# Altium project FLEXI_HAL_2000.PrjPCB (part 3 of 3)

## Sheet 2xparallelswitch_HALT.SchDoc: RP2040 CNC
size B; Author: AM; CompanyName: Expatria Technologies; DrawnBy: A.Marles; Engineer: AM; Organization: Expatria Technolgoies; DocumentNumber: 13; Revision: A5; SheetNumber: 13; SheetTotal: 14
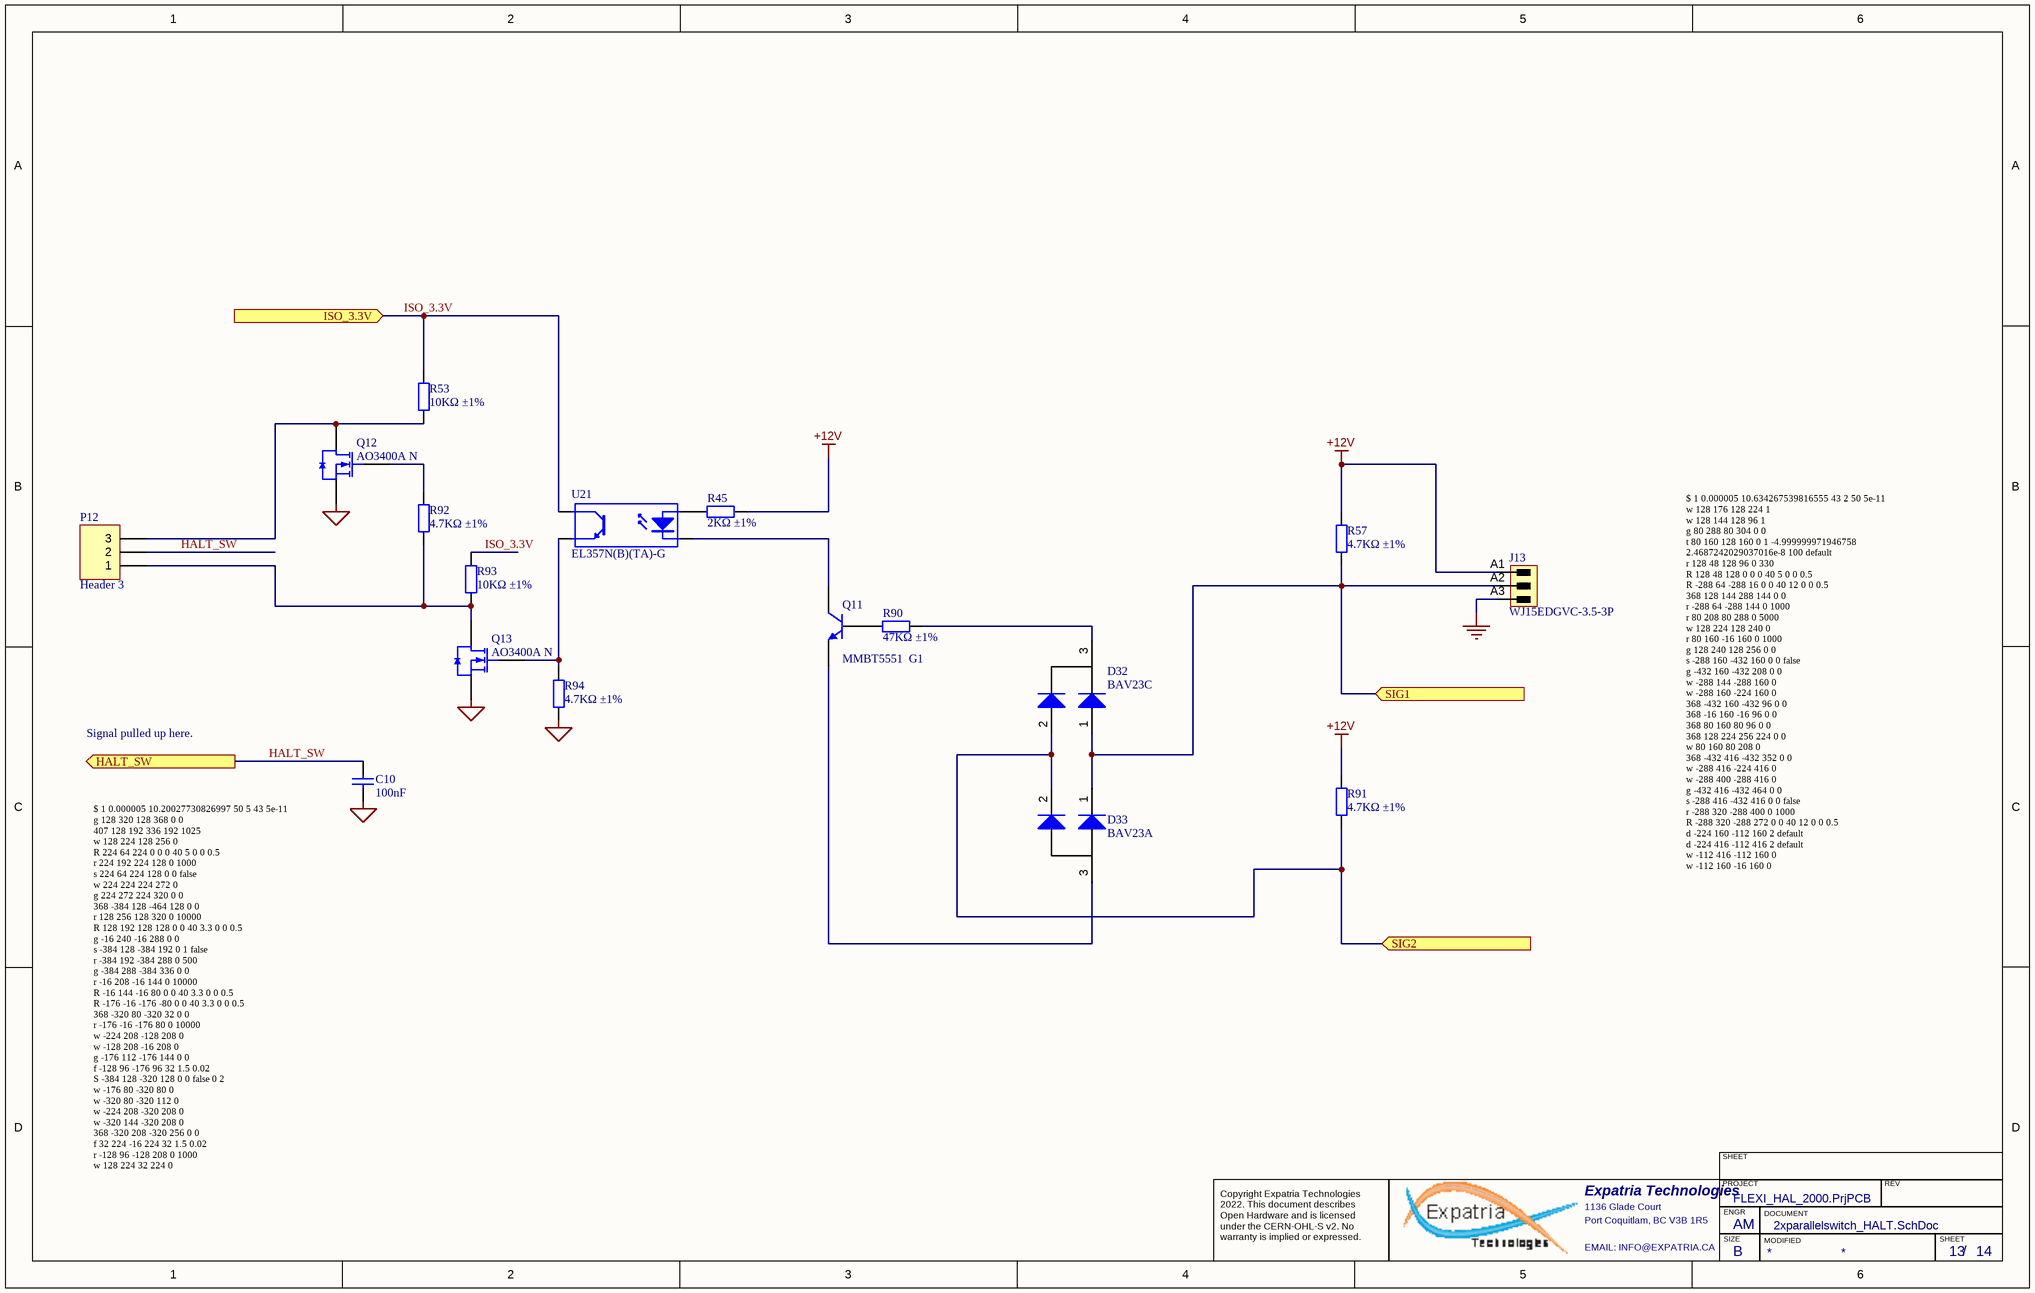
[diagram p12: 2xparallelswitch_HALT.SchDoc]

### Parts
C10  100nF  [0603_C]
D32  BAV23C  [SOT-23(SOT-23-3)]
D33  BAV23A  [SOT-23(SOT-23-3)]
J13  WJ15EDGVC-3.5-3P  [691321100003 - 3.5mm  3p]
P12  Header 3  [HDR1X3]
Q11  MMBT5551  G1  [SOT-23(SOT-23-3)]
Q12  AO3400A N  [SOT-23-3L]
Q13  AO3400A N  [SOT-23-3L]
R45  2KΩ ±1%  [0603_R]
R53  10KΩ ±1%  [0603_R]
R57  4.7KΩ ±1%  [0603_R]
R90  47KΩ ±1%  [0603_R]
R91  4.7KΩ ±1%  [0603_R]
R92  4.7KΩ ±1%  [0603_R]
R93  10KΩ ±1%  [0603_R]
R94  4.7KΩ ±1%  [0603_R]
U21  EL357N(B)(TA)-G  [SOP-4_P2.54]

### Ports
HALT_SW (out), ISO_3.3V (in), SIG1 (in), SIG2 (in)

### Nets
+12V: J13.A1 R45.2 R57.2 R91.2
GND: J13.A3
MCU_GND: C10.1 Q12.2(S) Q13.2(S) R94.1
HALT_SW: C10.2 P12.2 ; port HALT_SW
ISO_3.3V: R53.2 R93.2 U21.4(C) ; port ISO_3.3V
SIG1: D32.1(A) D33.1(K) J13.A2 R57.1 ; port SIG1
SIG2: D32.2(A) D33.2(K) R91.1 ; port SIG2
NetD32_3: D32.3(K) R90.1
NetD33_3: D33.3(A) Q11.2(E)
NetP12_1: P12.1 Q13.3(D) R92.1 R93.1
NetP12_3: P12.3 Q12.3(D) R53.1
NetQ11_1: Q11.1(B) R90.2
NetQ11_3: Q11.3(C) U21.2(K)
NetQ12_1: Q12.1(G) R92.2
NetQ13_1: Q13.1(G) R94.2 U21.3(E)
NetR45_1: R45.1 U21.1(A)

### Notes on the sheet
- Signal pulled up here.
- $ 1 0.000005 10.634267539816555 43 2 50 5e-11
  w 128 176 128 224 1
  w 128 144 128 96 1
  g 80 288 80 304 0 0
  t 80 160 128 160 0 1 -4.999999971946758 2.4687242029037016e-8 100 default
  r 128 48 128 96 0 330
  R 128 48 128 0 0 0 40 5 0 0 0.5
  R -288 64 -288 16 0 0 40 12 0 0 0.5
  368 128 144 288 144 0 0
  r -288 64 -288 144 0 1000
  r 80 208 80 288 0 5000
  w 128 224 128 240 0
  r 80 160 -16 160 0 1000
  g 128 240 128 256 0 0
  s -288 160 -432 160 0 0 false
  g -432 160 -432 208 0 0
  w -288 144 -288 160 0
  w -288 160 -224 160 0
  368 -432 160 -432 96 0 0
  368 -16 160 -16 96 0 0
  368 80 160 80 96 0 0
  368 128 224 256 224 0 0
  w 80 160 80 208 0
  368 -432 416 -432 352 0 0
  w -288 416 -224 416 0
  w -288 400 -288 416 0
  g -432 416 -432 464 0 0
  s -288 416 -432 416 0 0 false
  r -288 320 -288 400 0 1000
  R -288 320 -288 272 0 0 40 12 0 0 0.5
  d -224 160 -112 160 2 default
  d -224 416 -112 416 2 default
  w -112 416 -112 160 0
  w -112 160 -16 160 0
- (near C10) $ 1 0.000005 10.20027730826997 50 5 43 5e-11
  g 128 320 128 368 0 0
  407 128 192 336 192 1025
  w 128 224 128 256 0
  R 224 64 224 0 0 0 40 5 0 0 0.5
  r 224 192 224 128 0 1000
  s 224 64 224 128 0 0 false
  w 224 224 224 272 0
  g 224 272 224 320 0 0
  368 -384 128 -464 128 0 0
  r 128 256 128 320 0 10000
  R 128 192 128 128 0 0 40 3.3 0 0 0.5
  g -16 240 -16 288 0 0
  s -384 128 -384 192 0 1 false
  r -384 192 -384 288 0 500
  g -384 288 -384 336 0 0
  r -16 208 -16 144 0 10000
  R -16 144 -16 80 0 0 40 3.3 0 0 0.5
  R -176 -16 -176 -80 0 0 40 3.3 0 0 0.5
  368 -320 80 -320 32 0 0
  r -176 -16 -176 80 0 10000
  w -224 208 -128 208 0
  w -128 208 -16 208 0
  g -176 112 -176 144 0 0
  f -128 96 -176 96 32 1.5 0.02
  S -384 128 -320 128 0 0 false 0 2
  w -176 80 -320 80 0
  w -320 80 -320 112 0
  w -224 208 -320 208 0
  w -320 144 -320 208 0
  368 -320 208 -320 256 0 0
  f 32 224 -16 224 32 1.5 0.02
  r -128 96 -128 208 0 1000
  w 128 224 32 224 0
- SHEET
- Expatria Technologies
- 1136 Glade Court
- Port Coquitlam, BC V3B 1R5
- PROJECT
- SIZE
- ENGR
- MODIFIED
- DOCUMENT
- REV
- Copyright Expatria Technologies 2022. This document describes Open Hardware and is licensed under the CERN-OHL-S v2. No warranty is implied or expressed.
- EMAIL: INFO@EXPATRIA.CA
- B
- /

### Library data of the parts
C10 = 0603 100nF (104) 10% 50V: Chip capacitors; Manufacturer: YAGEO; PartNumber: CC0603KRX7R9BB104; Tolerance: 10%; Voltage: 50V; ComponentLink1Description: Supplier link; ComponentLink1URL: http://www.szlcsc.com/product/details_15331.html; Package: 0603; Supplier: LC; SuppliersPartNumber: C14663; Capacitance: 100nF
D32 = SOT-23 BAV23C: 250V +150℃@(Tj) 350mW Dual Common Cathode 1.25V@200mA 50ns 100nA@250V 225mA SOT-23 Switching Diode ROHS; ComponentLink1Description: 供应商链接; ComponentLink1URL: http://www.szlcsc.com/product/details_70091.html; Package: SOT-23; Supplier: LC; SuppliersPartNumber: C545540
D33 = SOT-23 BAV23A: 200V -65℃~+150℃@(Tj) 350mW 1 Pair Common Anode 1.25V@200mA 50ns 100nA@200V 400mA SOT-23 Switching Diode ROHS; ComponentLink1Description: 供应商链接; ComponentLink1URL: http://www.szlcsc.com/product/details_70091.html; Package: SOT-23; Supplier: LC; SuppliersPartNumber: C328584
J13 = 3.5mm Terminal Header 3p: Header,Male Pin,Covered(4 Sided) 3 1 0.138"（3.50mm） 3 P=3.5mm Pluggable System Terminal Block RoHS; Manufacturer: Weidmueller; Manufacturer 1: Weidmuller; Manufacturer Part Number 1: 1604480000; Pitch_mm: 3.5 mm; UL_94_flammability_rating: V-0; Side_termination_characteristic: closed side; Solder_pin_length_mm: 3.2 mm; Short_text_for_material: SL 3.50/03/180G 3.2SN OR BX; Pitch_inch: 0.138 inch; PartNumber: WJ15EDGVC-3.5-3P; PackageReference: SL_3_50_180G_03; ComponentLink1URL: http://www.weidmueller.com/; ComponentLink1Description: Manufacturer URL; Packaging: Box; Revision: V1; SuppliersPartNumber: C192778
P12 = Header 3: Header, 3-Pin; Publisher: Altium Limited; SuppliersPartNumber: C49257
Q11 = SOT-23 MMBT5551  G1: 三极管; ComponentLink1Description: 供应商链接; ComponentLink1URL: http://www.szlcsc.com/product/details_2502.html; Package: SOT-23; Supplier: LC; SuppliersPartNumber: C2145
Q12 Q13 = AO3400A N道沟 X0YV1T SOT-23: MOS(场效应管); ComponentLink1Description: 供应商链接; ComponentLink1URL: http://www.szlcsc.com/product/details_21629.html; Package: SOT-23; Supplier: LC; SuppliersPartNumber: C20917
R45 = 0603 2K (2001) 1%: Chip resistor; Manufacturer: Uniroyal Elec; PartNumber: 0603WAF2001T5E; Power: 1/10W; ComponentLink1Description: Supplier link; ComponentLink1URL: http://www.szlcsc.com/product/details_23702.html; Package: 0603; Supplier: LC; SuppliersPartNumber: C22975; Resistance: 2KΩ; Tolerance: 1%
R53 R93 = 0603 10K (1002) 1%: Chip resistor; Manufacturer: Uniroyal Elec; PartNumber: 0603WAF1002T5E; Power: 1/10W; ComponentLink1Description: Supplier link; ComponentLink1URL: http://www.szlcsc.com/product/details_26547.html; Package: 0603; Supplier: LC; SuppliersPartNumber: C25804; Resistance: 10KΩ; Tolerance: 1%
R57 R91 R92 R94 = 0603 4.7K (4701) 1%: Chip resistor; Manufacturer: Uniroyal Elec; PartNumber: 0603WAF4701T5E; Power: 1/10W; ComponentLink1Description: Supplier link; ComponentLink1URL: http://www.szlcsc.com/product/details_23889.html; Package: 0603; Supplier: LC; SuppliersPartNumber: C23162; Resistance: 4.7KΩ; Tolerance: 1%
R90 = 0603 47K (4702) 1%: Chip resistor; Manufacturer: Uniroyal Elec; PartNumber: 0603WAF4702T5E; Power: 1/10W; ComponentLink1Description: Supplier link; ComponentLink1URL: http://www.szlcsc.com/product/details_26562.html; Package: 0603; Supplier: LC; SuppliersPartNumber: C25819; Resistance: 47KΩ; Tolerance: 1%
U21 = EL357N(B)(TA)-G_[C6649]: 贴片光耦; ComponentLink1Description: 供应商链接; ComponentLink1URL: http://www.szlcsc.com/product/details_7114.html; Package: SOP-4_P2.54; Supplier: LC; SuppliersPartNumber: C6649

## Sheet MCU_STM32G0_Extender.SchDoc: STM32F446 CNC
size B; Author: AM; CompanyName: Expatria Technologies; DrawnBy: A.Marles; Engineer: AM; Organization: Expatria Technologies; DocumentNumber: 3; Revision: A5; SheetNumber: 3; SheetTotal: 14
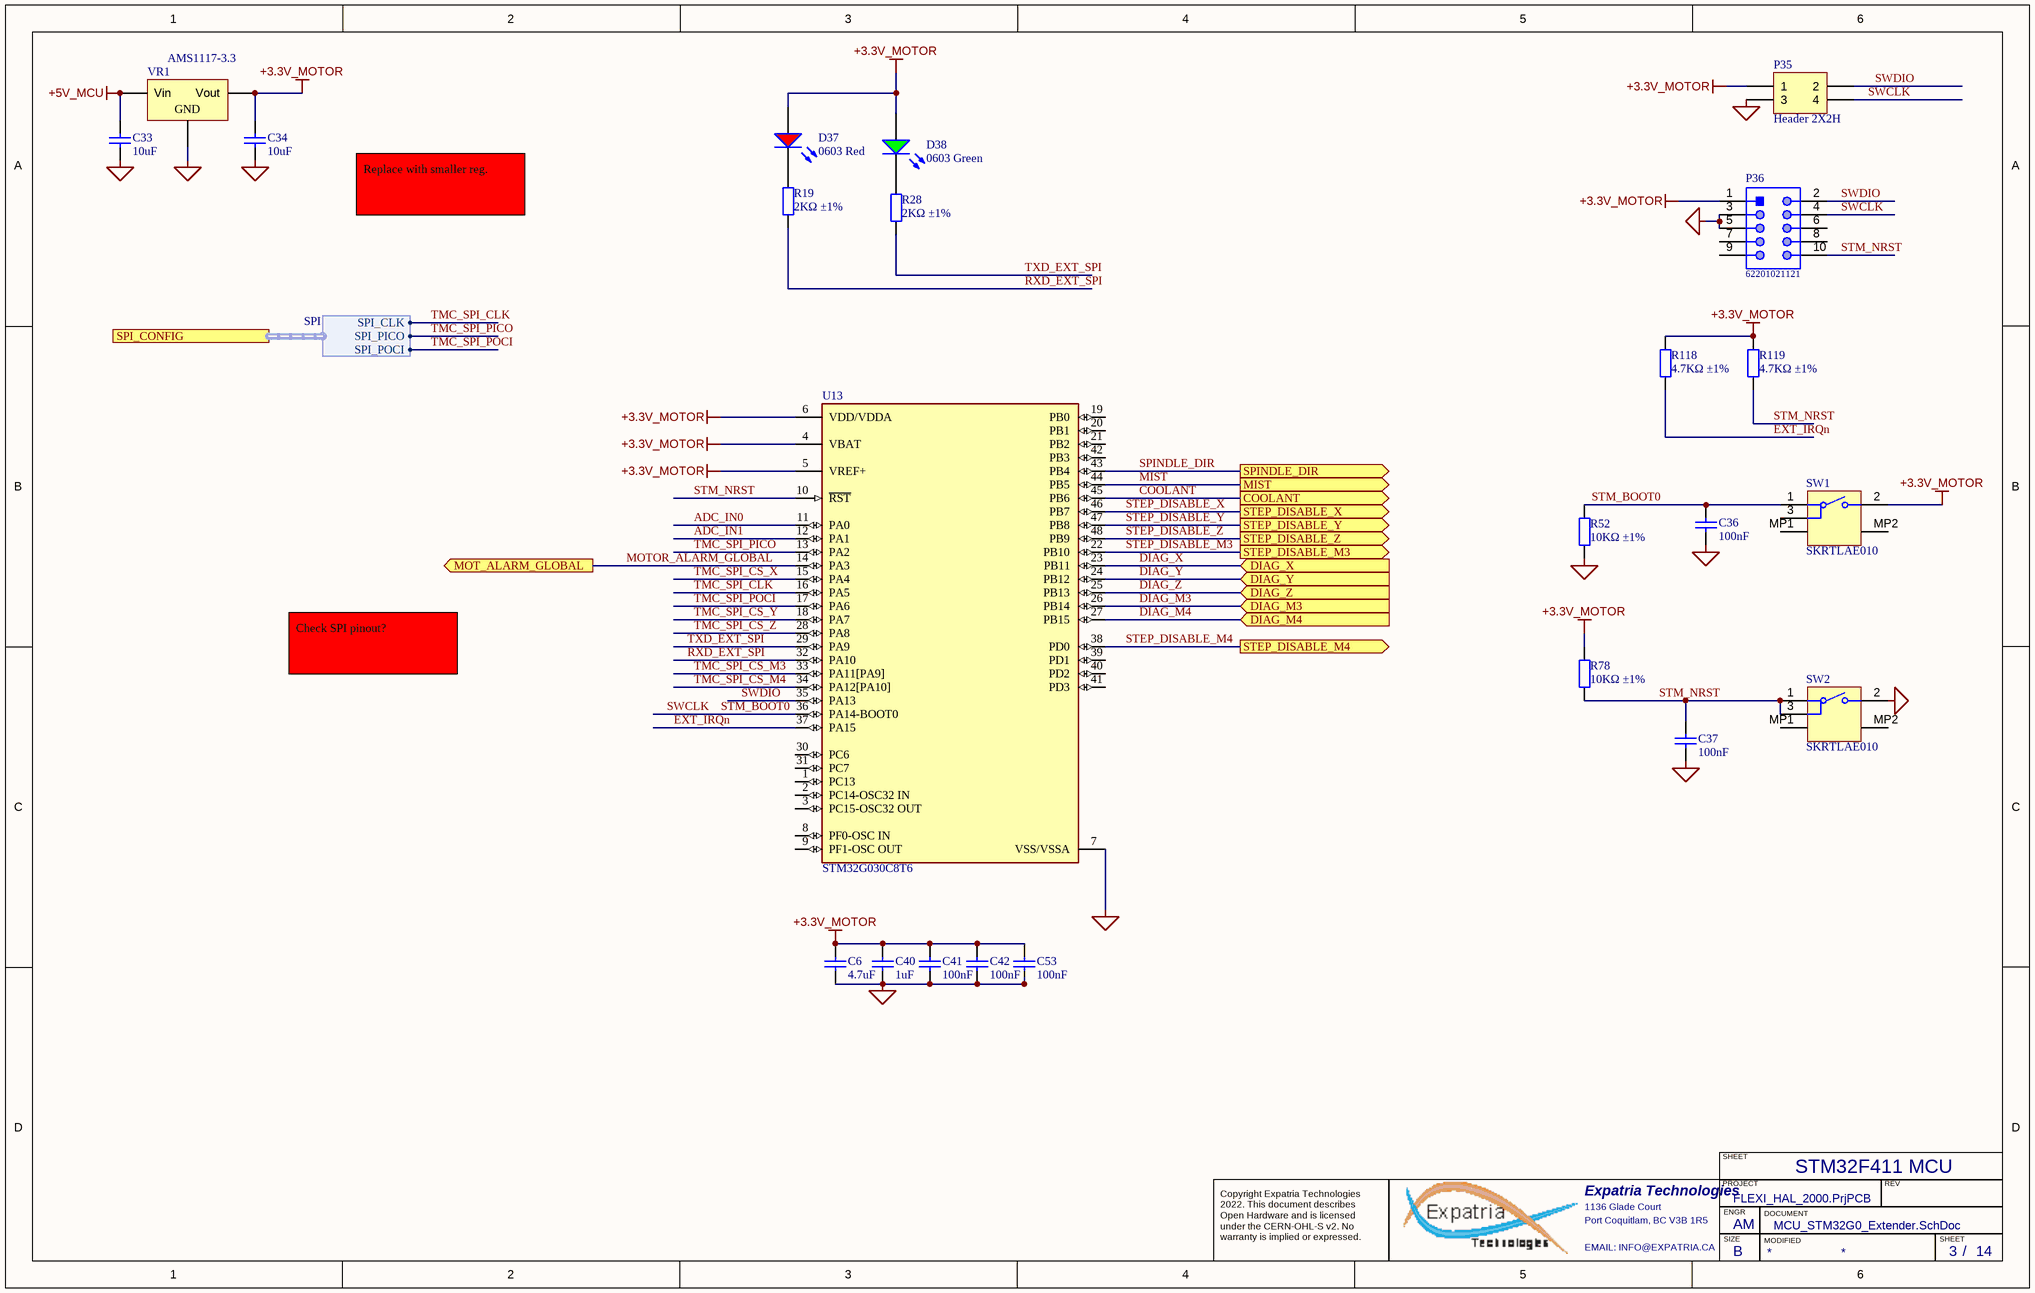
[diagram p13: MCU_STM32G0_Extender.SchDoc]

### Parts
(Parts that share a designator on the sheet are numbered #1, #2 ... from top to bottom, then left to right.)
C6#2  4.7uF  [0603_C]
C33  10uF  [1206_C]
C34  10uF  [1206_C]
C36  100nF  [0603_C]
C37  100nF  [0603_C]
C40  1uF  [0603_C]
C41  100nF  [0603_C]
C42  100nF  [0603_C]
C53  100nF  [0603_C]
D37  0603 Red  [0603_LED_S1]
D38#2  0603 Green  [0603_LED_S1]
P35#2  Header 2X2H  [HDR2X2H]
P36  62201021121  [62201021121]  (no BOM)
R19#2  2KΩ ±1%  [0603_R]
R28#2  2KΩ ±1%  [0603_R]
R52  10KΩ ±1%  [0603_R]
R78  10KΩ ±1%  [0603_R]
R118  4.7KΩ ±1%  [0603_R]
R119  4.7KΩ ±1%  [0603_R]
SW1  SKRTLAE010  [ALPS-SKRTLAE010_V]
SW2  SKRTLAE010  [ALPS-SKRTLAE010_V]
U13#2  STM32G030C8T6  [FP-LQFP48-5B-IPC_A]
VR1  AMS1117-3.3  [SOT-223]

### Ports
COOLANT (out), DIAG_M3 (in), DIAG_M4 (in), DIAG_X (in), DIAG_Y (in), DIAG_Z (in), MIST (out), MOT_ALARM_GLOBAL (out), SPI_CONFIG (harness SPI), SPINDLE_DIR (out), STEP_DISABLE_M3 (out), STEP_DISABLE_M4 (out), STEP_DISABLE_X (out), STEP_DISABLE_Y (out), STEP_DISABLE_Z (out)

### Harnesses
SPI: SPI_CLK, SPI_PICO, SPI_POCI

### Nets
+3.3V_MOTOR: C6#2.2 C34.2 C40.2 C41.2 C42.2 C53.2 D37.A D38#2.A P35#2.1 P36.1 R78.1 R118.2 R119.2 SW1.2 U13#2.4(VBAT) U13#2.5(VREF+) U13#2.6(VDD/VDDA) VR1.2(Vout)
+5V_MCU: C33.2 VR1.3(Vin)
MCU_GND: C6#2.1 C33.1 C34.1 C36.1 C37.1 C40.1 C41.1 C42.1 C53.1 P35#2.3 P36.3 P36.5 R52.2 SW2.2 U13#2.7(VSS/VSSA) VR1.1(GND)
ADC_IN0: U13#2.11(PA0)
ADC_IN1: U13#2.12(PA1)
COOLANT: U13#2.45(PB6) ; port COOLANT
DIAG_M3: U13#2.26(PB14) ; port DIAG_M3
DIAG_M4: U13#2.27(PB15) ; port DIAG_M4
DIAG_X: U13#2.23(PB11) ; port DIAG_X
DIAG_Y: U13#2.24(PB12) ; port DIAG_Y
DIAG_Z: U13#2.25(PB13) ; port DIAG_Z
EXT_IRQn: R118.1 U13#2.37(PA15)
MIST: U13#2.44(PB5) ; port MIST
MOTOR_ALARM_GLOBAL: U13#2.14(PA3) ; port MOT_ALARM_GLOBAL
RXD_EXT_SPI: R19#2.1 U13#2.32(PA10)
SPINDLE_DIR: U13#2.43(PB4) ; port SPINDLE_DIR
STEP_DISABLE_M3: U13#2.22(PB10) ; port STEP_DISABLE_M3
STEP_DISABLE_M4: U13#2.38(PD0) ; port STEP_DISABLE_M4
STEP_DISABLE_X: U13#2.46(PB7) ; port STEP_DISABLE_X
STEP_DISABLE_Y: U13#2.47(PB8) ; port STEP_DISABLE_Y
STEP_DISABLE_Z: U13#2.48(PB9) ; port STEP_DISABLE_Z
STM_BOOT0: C36.2 P35#2.4 P36.4 R52.1 SW1.1 U13#2.36(PA14-BOOT0)  [also labelled SWCLK]
STM_NRST: C37.2 P36.10 R78.2 R119.1 SW2.1 SW2.3 U13#2.10(~{RST})
SWDIO: P35#2.2 P36.2 U13#2.35(PA13)
TMC_SPI_CLK: U13#2.16(PA5) ; port SPI_CONFIG.SPI_CLK
TMC_SPI_CS_M3: U13#2.33(PA11[PA9])
TMC_SPI_CS_M4: U13#2.34(PA12[PA10])
TMC_SPI_CS_X: U13#2.15(PA4)
TMC_SPI_CS_Y: U13#2.18(PA7)
TMC_SPI_CS_Z: U13#2.28(PA8)
TMC_SPI_PICO: U13#2.13(PA2) ; port SPI_CONFIG.SPI_PICO
TMC_SPI_POCI: U13#2.17(PA6) ; port SPI_CONFIG.SPI_POCI
TXD_EXT_SPI: R28#2.1 U13#2.29(PA9)
NetD37_K: D37.K R19#2.2
NetD38#2_K: D38#2.K R28#2.2

Not connected (* = marked no-connect by the designer): P36 6 7 8 9; SW1 3 MP1 MP2; SW2 MP1 MP2; U13#2 1(PC13) 2(PC14-OSC32_IN) 3(PC15-OSC32_OUT) 8(PF0-OSC_IN) 9(PF1-OSC_OUT) 19(PB0) 20(PB1) 21(PB2) 30(PC6) 31(PC7) 39(PD1) 40(PD2) 41(PD3) 42(PB3)

### Notes on the sheet
- Replace with smaller reg.
- Check SPI pinout?
- STM32F411 MCU
- SHEET
- Expatria Technologies
- 1136 Glade Court
- Port Coquitlam, BC V3B 1R5
- PROJECT
- SIZE
- ENGR
- MODIFIED
- DOCUMENT
- REV
- Copyright Expatria Technologies 2022. This document describes Open Hardware and is licensed under the CERN-OHL-S v2. No warranty is implied or expressed.
- EMAIL: INFO@EXPATRIA.CA
- B
- /

### Library data of the parts
C6#2 = 0603 4.7uF (475) 10% 16V: Chip capacitors; Manufacturer: Samsung Electro-Mechanics; PartNumber: CL10A475KO8NNNC; Tolerance: 10%; Voltage: 16V; ComponentLink1Description: Supplier link; ComponentLink1URL: http://www.szlcsc.com/product/details_20375.html; Package: 0603; Supplier: LC; SuppliersPartNumber: C19666; Capacitance: 4.7uF
C33 C34 = 1206 10uF (106) 10% 50V: Chip capacitors; Manufacturer: Samsung Electro-Mechanics; PartNumber: CL31A106KBHNNNE; Tolerance: 10%; Voltage: 50V; ComponentLink1Description: Supplier link; ComponentLink1URL: http://www.szlcsc.com/product/details_14236.html; Package: 1206; Supplier: LC; SuppliersPartNumber: C13585; Capacitance: 10uF; Manufacturer 1: Samsung Electro-Mechanics
C36 C37 C41 C42 C53 = 0603 100nF (104) 10% 50V: as C10 on sheet 2xparallelswitch_HALT; ComponentLink1Description: Supplier link; ComponentLink1URL: http://www.szlcsc.com/product/details_15331.html; Package: 0603; Supplier: LC; SuppliersPartNumber: C14663; Capacitance: 100nF
C40 = 0603 1uF (105) 10% 50V: Chip capacitors; Manufacturer: Samsung Electro-Mechanics; PartNumber: CL10A105KB8NNNC; Tolerance: 10%; Voltage: 50V; ComponentLink1Description: Supplier link; ComponentLink1URL: http://www.szlcsc.com/product/details_16531.html; Package: 0603; Supplier: LC; SuppliersPartNumber: C15849; Capacitance: 1uF
D37 = 0603 LED Red: LED; ComponentLink1Description: 供应商链接; ComponentLink1URL: http://www.szlcsc.com/product/details_2659.html; Package: 0603; Supplier: LC; SuppliersPartNumber: C2286; Color: Red
D38#2 = 0603 LED Green: LED; ComponentLink1Description: 供应商链接; ComponentLink1URL: http://www.szlcsc.com/product/details_73152.html; Package: 0603; Supplier: LC; SuppliersPartNumber: C72043; Color: Green
P35#2 = Header 2X2H: Header, 2-Pin, Dual row, Right Angle; LatestRevisionDate: 17-Jul-2002; LatestRevisionNote: Re-released for DXP Platform.; Publisher: Altium Limited
P36 = CMP-1502-00948-1: THT Vertical Pin Header WR-PHD, Pitch 1.27 mm, Dual Row, 10 pins; Manufacturer: Wurth Elektronik; Rated Current: 1A; Pin Number: 10; Working Voltage: 100VAC; Contact Resistance: 20mOhm; Withstanding Voltage: 500VAC; Pitch: 1.27mm; Gender: Male; Mounting Technology: THT; Manufacturer URL: http://www.we-online.de; Package Reference: 62201021121; Row Number: Dual; Datasheet URL: https://katalog.we-online.de/em/datasheet/62201021121.pdf; Publisher: WurthElektronik; Packaging: Box; Operating Temperature: -40to105degC; Orientation: Vertical; Part Number: 62201021121
R19#2 R28#2 = 0603 2K (2001) 1%: as R45 on sheet 2xparallelswitch_HALT; ComponentLink1Description: Supplier link; ComponentLink1URL: http://www.szlcsc.com/product/details_23702.html; Package: 0603; Supplier: LC; SuppliersPartNumber: C22975; Resistance: 2KΩ; Tolerance: 1%
R52 R78 = 0603 10K (1002) 1%: as R53 on sheet 2xparallelswitch_HALT; ComponentLink1Description: Supplier link; ComponentLink1URL: http://www.szlcsc.com/product/details_26547.html; Package: 0603; Supplier: LC; SuppliersPartNumber: C25804; Resistance: 10KΩ; Tolerance: 1%
R118 R119 = 0603 4.7K (4701) 1%: as R57 on sheet 2xparallelswitch_HALT; ComponentLink1Description: Supplier link; ComponentLink1URL: http://www.szlcsc.com/product/details_23889.html; Package: 0603; Supplier: LC; SuppliersPartNumber: C23162; Resistance: 4.7KΩ; Tolerance: 1%
SW1 SW2 = CMP-2000-07073-2: Side Push Type, 250 V, -40 to 90 degC, 3-Pin SMD, RoHS, Tape and Reel; Manufacturer: ALPS; Operating Force: 1.6N; Folder: Unified Components\Components\New Releases\New\; Maximum Current Rating: 0.05@12VDCA; RevisionId: 1; Pole Throw Configuration: SPST; Switch Configuration: N.O.; AccessRights: 2147483647; Maximum DC Voltage Rating: 12V; ContentType: Unified Component; Rad Hard: No; Mounting: SurfaceMount; Datasheet URL: http://www.alps.com/prod/info/E/PDF/Tact/SurfaceMount/SKRT/SKRT.PDF; Manufacturer URL: http://www.alps.com/e/; ReleaseDate: 22/09/2017 06:13:25 AM; ItemHRID: CMP-2000-07073; ContentTypeGUID: CB3C11C4-E317-11DF-B822-12313F0024A2; LifeCycle: Released; ItemGUID: EAC55BEC-37DC-4BDB-8BA7-D75E6D5C3D75; Packaging: Tape&Reel; Package Reference: SKRTLAE010; FolderGUID: B7F4506A-9127-42E7-A087-46FE7B18D116; Datasheet Version: 06/2015; Mounting Technology: SurfaceMount; LifeCycleStateGUID: 61E382EE-6656-4F12-9E24-BE9327104A25; Package Description: 3-Pin Surface Mount Device, Body 4.5 x 3.55 mm, Pitch 1.225 mm; SuppliersPartNumber: C110293; Manufacturer 1: ALPS
U13#2 = CMP-12105-000142-1: IC MCU 32BIT 64KB FLASH 48LQFP; RoHS Compliant: Yes
VR1 = SOT-223 AMS1117-3.3: Vout=3.3V 1A 72dB@(120Hz) (LDO); Manufacturer 1: AMS; ComponentLink1Description: 供应商链接; ComponentLink1URL: http://www.szlcsc.com/product/details_6652.html; Package: SOT-223; Supplier: LC; SuppliersPartNumber: C6186; Manufacturer Part Number 1: AMS1117-3.3

## Nets that join several sheets
+3.3V: STM32F446RE_board (8 pins), Limit_Switches (6 pins), LIM_SW/PH_DR (R20_LIM_SW_PH_DR#1.2), LIM_SW/PH_DR (R20_LIM_SW_PH_DR#2.2), LIM_SW/PH_DR (R20_LIM_SW_PH_DR#3.2), LIM_SW/PH_DR (R20_LIM_SW_PH_DR#4.2), LIM_SW/PH_DR (R20_LIM_SW_PH_DR#5.2), LIM_SW/PH_DR (R20_LIM_SW_PH_DR#6.2), Misc_switches (5 pins), USR_SW/PH_CY (R20_PH_CY.2), USR_SW/PH_FD (R20_PH_FD.2), USR_SW/PH_DR (R20_USR_SW_PH_DR.2), USR_SW/PH_TL (R20_PH_TL.2), USR_SW/PH_PR (R20_PH_PR.2), MCU_STM32F446RE (28 pins)
+5V: STM32F446RE_board (10 pins), Spindle_Control (P6.1), RS485 (C108.2 L4.1 R89.2), 5V_Power_Supply (6 pins), Aux_Outputs (P2.1)
+5V_MCU: STM32F446RE_board (9 pins), Spindle_Control (R23.1 R28#1.1), RS485 (D59.A), MCU_STM32F446RE (C58.2 VR4.3), MCU_STM32G0_Extender (C33.2 VR1.3)
+12V: 2xparallelswitch (5 pins), STM32F446RE_board (5 pins), Spindle_Control (D39.A P6.3 U3.4), Aux_Outputs (D9#2.1 P2.3), 2xparallelswitch_HALT (J13.A1 R45.2 R57.2 R91.2)
+24V: STM32F446RE_board (6 pins), 5V_Power_Supply (C46.2 C47.2 U23.2)
GND: 2xparallelswitch (J1#1.A3 J2#1.A3), STM32F446RE_board (19 pins), Spindle_Control (P16.1 Q16.2 R22.1), RS485 (C108.1 L6.1), 5V_Power_Supply (12 pins), Aux_Outputs (7 pins), 2xparallelswitch_HALT (J13.A3)
MCU_GND: 2xparallelswitch (C5#1.1 U1#1.3), STM32F446RE_board (28 pins), LIM_SW/PH_DR (C54_LIM_SW_PH_DR#1.1 U2_LIM_SW_PH_DR#1.3), LIM_SW/PH_DR (C54_LIM_SW_PH_DR#2.1 U2_LIM_SW_PH_DR#2.3), LIM_SW/PH_DR (C54_LIM_SW_PH_DR#3.1 U2_LIM_SW_PH_DR#3.3), LIM_SW/PH_DR (C54_LIM_SW_PH_DR#4.1 U2_LIM_SW_PH_DR#4.3), LIM_SW/PH_DR (C54_LIM_SW_PH_DR#5.1 U2_LIM_SW_PH_DR#5.3), LIM_SW/PH_DR (C54_LIM_SW_PH_DR#6.1 U2_LIM_SW_PH_DR#6.3), USR_SW/PH_CY (C54_PH_CY.1 U2_PH_CY.3), USR_SW/PH_FD (C54_PH_FD.1 U2_PH_FD.3), USR_SW/PH_DR (C54_USR_SW_PH_DR.1 U2_USR_SW_PH_DR.3), USR_SW/PH_TL (C54_PH_TL.1 U2_PH_TL.3), USR_SW/PH_PR (C54_PH_PR.1 U2_PH_PR.3), Stepper_driver_group (C9#1.2), Spindle_Control (Q1#2.2 R37.2 U6.2 U8.2), RS485 (Q18.2), MCU_STM32F446RE (36 pins), 2xparallelswitch_HALT (C10.1 Q12.2 Q13.2 R94.1), MCU_STM32G0_Extender (16 pins)
RELAY_VCC: STM32F446RE_board (5 pins), Spindle_Control (D23.2 P13.A1), Aux_Outputs (D11#2.2 FUSE2.2)
A_LIM: Limit_Switches (R19#1.2), LIM_SW/PH_DR (C54_LIM_SW_PH_DR#4.2 R20_LIM_SW_PH_DR#4.1 U2_LIM_SW_PH_DR#4.4), MCU_STM32F446RE (U22.58)
B_LIM: STM32F446RE_board (R44.1), Limit_Switches (R24#1.2), LIM_SW/PH_DR (C54_LIM_SW_PH_DR#5.2 R20_LIM_SW_PH_DR#5.1 U2_LIM_SW_PH_DR#5.4), MCU_STM32F446RE (U22.3)
C_LIM: Limit_Switches (R25#1.2), LIM_SW/PH_DR (C54_LIM_SW_PH_DR#6.2 R20_LIM_SW_PH_DR#6.1 U2_LIM_SW_PH_DR#6.4)
CYC/ST: Misc_switches (R11.2), USR_SW/PH_CY (C54_PH_CY.2 R20_PH_CY.1 U2_PH_CY.4), MCU_STM32F446RE (U22.52)
DOOR: STM32F446RE_board (R43.1), Misc_switches (R74.2), USR_SW/PH_DR (C54_USR_SW_PH_DR.2 R20_USR_SW_PH_DR.1 U2_USR_SW_PH_DR.4), MCU_STM32F446RE (U22.24)
EXT_IN0_BUF: STM32F446RE_board (U15.7), MCU_STM32F446RE (U22.14)
EXT_IN1_BUF: STM32F446RE_board (U15.6), MCU_STM32F446RE (U22.15)
FD/HLD: Misc_switches (R14.2), USR_SW/PH_FD (C54_PH_FD.2 R20_PH_FD.1 U2_PH_FD.4), MCU_STM32F446RE (U22.39)
HALT_n: STM32F446RE_board (R79.1), MCU_STM32F446RE (U22.33)
KPSTR: STM32F446RE_board (A1.15), MCU_STM32F446RE (R42.1 U22.29)
PROBE: Misc_switches (R10.2), USR_SW/PH_PR (C54_PH_PR.2 R20_PH_PR.1 U2_PH_PR.4), MCU_STM32F446RE (U22.40)
PRU_RESET: STM32F446RE_board (A1.22), MCU_STM32F446RE (U22.11)
RXD_EXT: STM32F446RE_board (A1.29 P10.3 P19.6 U16.6), MCU_STM32F446RE (R39.1 U22.25)
RXD_INT: STM32F446RE_board (P19.1), MCU_STM32F446RE (U22.43)
SCL: STM32F446RE_board (A1.5), MCU_STM32F446RE (R64.1 U22.37 U27.6)
SDA: STM32F446RE_board (A1.3), MCU_STM32F446RE (R63#2.1 U22.38 U27.5)
SPI_CLK: STM32F446RE_board (A1.23), MCU_STM32F446RE (R17#2.2)
SPI_CS_JOG_SW: STM32F446RE_board (A1.24), MCU_STM32F446RE (U22.50)
SPI_MISO: STM32F446RE_board (A1.21), MCU_STM32F446RE (R58.2)
SPI_MOSI: STM32F446RE_board (A1.19), MCU_STM32F446RE (R83.2)
SPINDLE_EN: Spindle_Control (Q1#2.1 R37.1), MCU_STM32F446RE (U22.23)
SPINDLE_PWM: Spindle_Control (R9.1), MCU_STM32F446RE (U22.41)
STM_BOOT0: STM32F446RE_board (R1.1), MCU_STM32F446RE (C57.2 R62.1 SW3.1 U22.60)
STM_RESET: STM32F446RE_board (A1.11), MCU_STM32F446RE (7 pins)
TOOL: Misc_switches (R17#1.2), USR_SW/PH_TL (C54_PH_TL.2 R20_PH_TL.1 U2_PH_TL.4)
TXD_EXT: STM32F446RE_board (A1.7 P10.2 P19.5), MCU_STM32F446RE (R40#2.1 U22.51)
TXD_INT: STM32F446RE_board (P19.2), MCU_STM32F446RE (U22.42)
USB_D_N: STM32F446RE_board (J5.A7 J5.B7), MCU_STM32F446RE (R71.2)
USB_D_P: STM32F446RE_board (J5.A6 J5.B6), MCU_STM32F446RE (R72.2)
X_LIM: Limit_Switches (R6.2), LIM_SW/PH_DR (C54_LIM_SW_PH_DR#1.2 R20_LIM_SW_PH_DR#1.1 U2_LIM_SW_PH_DR#1.4), MCU_STM32F446RE (U22.21)
Y_LIM: Limit_Switches (R15.2), LIM_SW/PH_DR (C54_LIM_SW_PH_DR#2.2 R20_LIM_SW_PH_DR#2.1 U2_LIM_SW_PH_DR#2.4), MCU_STM32F446RE (U22.62)
Z_LIM: Limit_Switches (R16.2), LIM_SW/PH_DR (C54_LIM_SW_PH_DR#3.2 R20_LIM_SW_PH_DR#3.1 U2_LIM_SW_PH_DR#3.4), MCU_STM32F446RE (U22.2)

## Assembly variants
SMT_ONLY: not fitted A1 J1_LS_A J1_LS_X J1_LS_Y J1_LS_Z J2_LS_A J2_LS_X J2_LS_Y J2_LS_Z J3_PH_CY J3_PH_CY J3_PH_FD J3_PH_HLT J3_PH_PR J4 J6 J6 J7 J8 J8 J9 P1 P2 P2 P3 P3 P4 P4 P5 P5 P6 P6 P7 P7 P8 P9 P9 P10 P10 P11 P11 P12 P12 P13 P13 P14 P14 P16 P16 P17 P18 P19 P19 P20 P20 P21 P21 P22 P22 P23 P23 P24 P24 P25 P25 P26 P27 P28 P29 R? U30
FULL_PLACE: not fitted P1 P8 P8 P18 P18 P20 R43 R44 R? U30